# EAGLE design Flag Register (EAGLE 9.6.1)
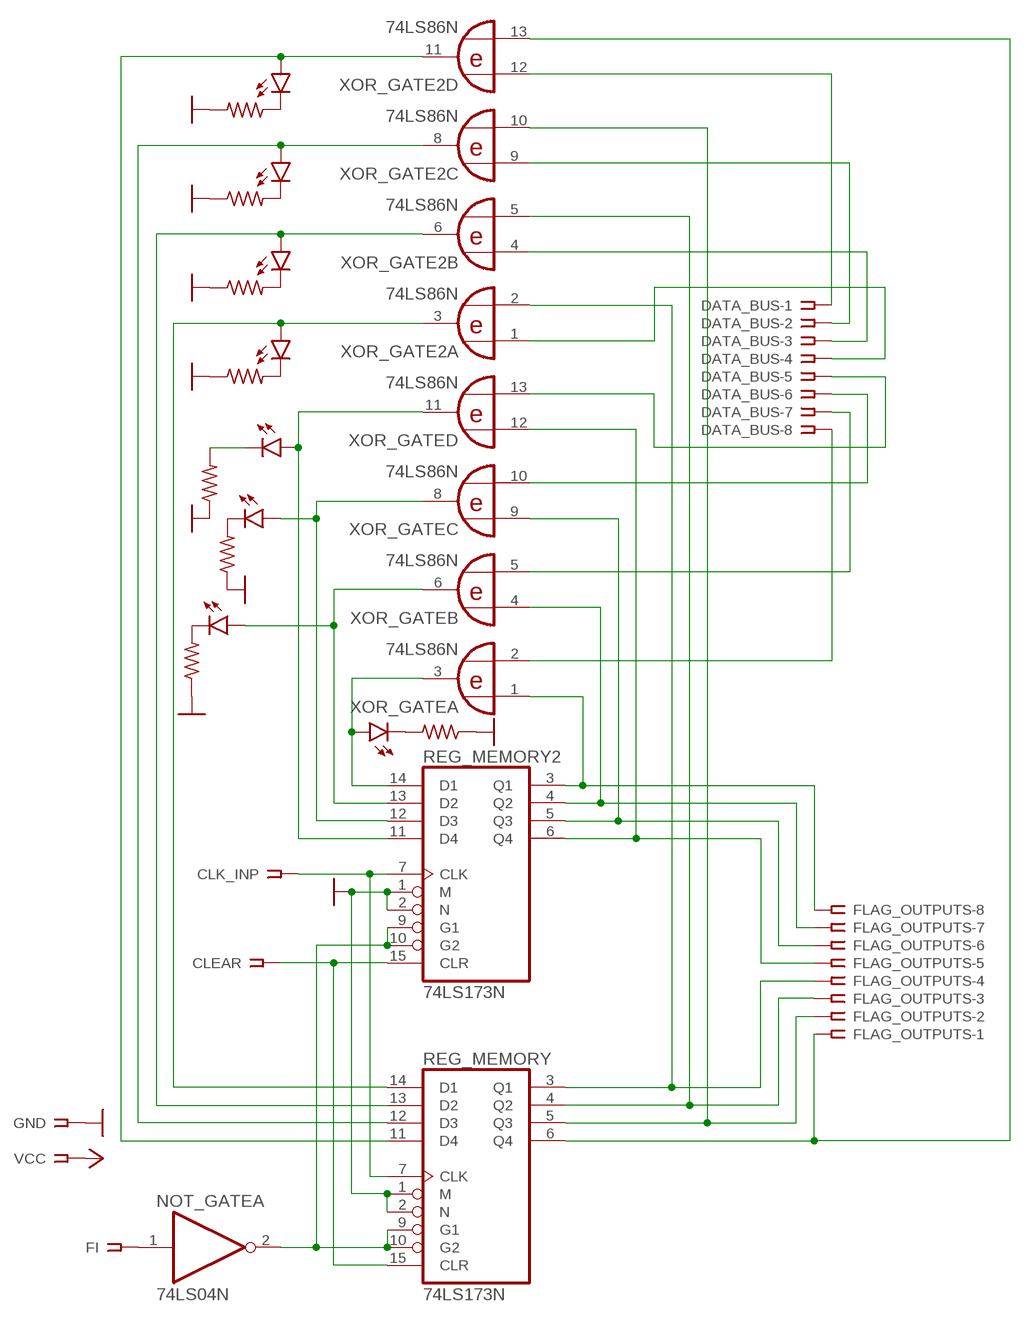
[diagram p0: schematic, sheet 1]

## Parts
CLEAR  SSW-101-02-G-S-RA  [SSW-101-02-G-S-RA]
CLK_INP  SSW-101-02-G-S-RA  [SSW-101-02-G-S-RA]
DATA_BUS  SSW-108-02-G-S  [SSW-108-02-G-S]
FI  SSW-101-02-G-S-RA  [SSW-101-02-G-S-RA]
FLAG_OUTPUTS  SSW-108-02-G-S  [SSW-108-02-G-S]
GND  SSW-101-02-G-S-RA  [SSW-101-02-G-S-RA]
LED1  LED5MM  [LED5MM]
LED2  LED5MM  [LED5MM]
LED3  LED5MM  [LED5MM]
LED4  LED5MM  [LED5MM]
LED5  LED5MM  [LED5MM]
LED6  LED5MM  [LED5MM]
LED7  LED5MM  [LED5MM]
LED8  LED5MM  [LED5MM]
NOT_GATE  74LS04N  [DIL14]
R2  220  R-US_0204/7  [0204/7]
R3  220  R-US_0204/7  [0204/7]
R4  220  R-US_0204/7  [0204/7]
R5  220  R-US_0204/7  [0204/7]
R6  220  R-US_0204/7  [0204/7]
R7  220  R-US_0204/7  [0204/7]
R8  220  R-US_0204/7  [0204/7]
R9  220  R-US_0204/7  [0204/7]
REG_MEMORY  74LS173N  [DIL16]
REG_MEMORY2  74LS173N  [DIL16]
VCC  SSW-101-02-G-S-RA  [SSW-101-02-G-S-RA]
XOR_GATE  74LS86N  [DIL14]
XOR_GATE2  74LS86N  [DIL14]

## Nets
GND: GND.1 R2.2 R3.1 R4.1 R5.1 R6.1 R7.1 R8.1 R9.1 REG_MEMORY2.1(M) REG_MEMORY2.2(N) REG_MEMORY.1(M) REG_MEMORY.2(N)
N$1: CLK_INP.1 REG_MEMORY2.7(CLK) REG_MEMORY.7(CLK)
N$2: FLAG_OUTPUTS.8 REG_MEMORY2.3(Q1) XOR_GATE.1(A:I0)
N$3: CLEAR.1 REG_MEMORY2.15(CLR) REG_MEMORY.15(CLR)
N$4: FLAG_OUTPUTS.7 REG_MEMORY2.4(Q2) XOR_GATE.4(B:I0)
N$5: FLAG_OUTPUTS.6 REG_MEMORY2.5(Q3) XOR_GATE.9(C:I0)
N$6: FLAG_OUTPUTS.5 REG_MEMORY2.6(Q4) XOR_GATE.12(D:I0)
N$7: FLAG_OUTPUTS.1 REG_MEMORY.6(Q4) XOR_GATE2.13(D:I1)
N$8: FLAG_OUTPUTS.2 REG_MEMORY.5(Q3) XOR_GATE2.10(C:I1)
N$9: FLAG_OUTPUTS.3 REG_MEMORY.4(Q2) XOR_GATE2.5(B:I1)
N$10: FLAG_OUTPUTS.4 REG_MEMORY.3(Q1) XOR_GATE2.2(A:I1)
N$11: DATA_BUS.8 XOR_GATE.2(A:I1)
N$12: DATA_BUS.7 XOR_GATE.5(B:I1)
N$13: DATA_BUS.6 XOR_GATE.10(C:I1)
N$14: DATA_BUS.5 XOR_GATE.13(D:I1)
N$15: NOT_GATE.2(A:O) REG_MEMORY2.9(G1) REG_MEMORY2.10(G2) REG_MEMORY.9(G1) REG_MEMORY.10(G2)
N$16: DATA_BUS.4 XOR_GATE2.1(A:I0)
N$17: DATA_BUS.3 XOR_GATE2.4(B:I0)
N$18: DATA_BUS.2 XOR_GATE2.9(C:I0)
N$19: DATA_BUS.1 XOR_GATE2.12(D:I0)
N$20: LED2.K(C) R3.2
N$21: LED8.A REG_MEMORY2.14(D1) XOR_GATE.3(A:O)
N$22: LED7.A REG_MEMORY2.13(D2) XOR_GATE.6(B:O)
N$23: LED6.A REG_MEMORY2.12(D3) XOR_GATE.8(C:O)
N$24: LED5.A REG_MEMORY2.11(D4) XOR_GATE.11(D:O)
N$25: LED4.A REG_MEMORY.14(D1) XOR_GATE2.3(A:O)
N$26: LED3.A REG_MEMORY.13(D2) XOR_GATE2.6(B:O)
N$27: LED2.A REG_MEMORY.12(D3) XOR_GATE2.8(C:O)
N$28: LED1.A REG_MEMORY.11(D4) XOR_GATE2.11(D:O)
N$29: LED3.K(C) R4.2
N$30: LED4.K(C) R5.2
N$31: LED5.K(C) R6.2
N$32: LED6.K(C) R7.2
N$33: LED7.K(C) R8.2
N$34: LED8.K(C) R9.2
N$35: LED1.K(C) R2.1
N$36: FI.1 NOT_GATE.1(A:I)
VCC: VCC.1
Unconnected: NOT_GATE.3(B:I) NOT_GATE.4(B:O) NOT_GATE.5(C:I) NOT_GATE.6(C:O) NOT_GATE.8(D:O) NOT_GATE.9(D:I) NOT_GATE.10(E:O) NOT_GATE.11(E:I) NOT_GATE.12(F:O) NOT_GATE.13(F:I)

## Power pins joined to a net without a drawn wire
GND: NOT_GATE.7(P:GND) REG_MEMORY2.8(GND) REG_MEMORY.8(GND) XOR_GATE2.7(P:GND) XOR_GATE.7(P:GND)
VCC: NOT_GATE.14(P:VCC) REG_MEMORY2.16(VCC) REG_MEMORY.16(VCC) XOR_GATE2.14(P:VCC) XOR_GATE.14(P:VCC)

## Library data of the parts
CLEAR CLK_INP FI GND VCC = con-samtec:SSW-101-02-G-S: THROUGH-HOLE .025" SQ POST SOCKET Source: Samtec SSW.pdf; MF: Samtec Inc.; MPN: SSW-101-02-G-S-RA; OC_FARNELL: unknown; OC_NEWARK: 11P9337
DATA_BUS FLAG_OUTPUTS = con-samtec:SSW-108-02-G-S: THROUGH-HOLE .025" SQ POST SOCKET Source: Samtec SSW.pdf; MF: Samtec Inc.; MPN: SSW-108-02-G-S; OC_FARNELL: unknown; OC_NEWARK: 11P9448
LED1-LED8 = led:LED: LED OSRAM: - CHIPLED LG R971, LG N971, LY N971, LG Q971, LY Q971, LO R971, LY R971 LH N974, LH R974 LS Q976, LO Q976, LY Q976 LO Q996 - Hyper CHIPLED LW Q18S LB Q993, LB Q99A, LB R99A - SideLED LS A670, LO A670, LY A670, LG A670, LP A670 LB A673, LV A673, LT A673, LW A673 LH A674 LY A675 LS A676, LA A676, LO A676, LY A676, LW A676 LS A679, LY A679, LG A679 - Hyper Micro SIDELED® LS Y876, LA Y876, LO Y876, LY Y876 LT Y87S - SmartLED LW L88C, LW L88S LB L89C, LB L89S, LG L890 LS L89K, LO L89K, LY L89K LS L896, LA L896, LO L896, LY L896 - TOPLED LS T670, LO T670, LY T670, LG T670, LP T670 LSG T670, LSP T670, LSY T670, LOP T670, LYG T670 LG T671, LOG T671, LSG T671 LB T673, LV T673, LT T673, LW T673 LH T674 LS T676, LA T676, LO T676, LY T676, LB T676, LH T676, LSB T676, LW T676 LB T67C, LV T67C, LT T67C, LS T67K, LO T67K, LY T67K, LW E67C LS E67B, LA E67B, LO E67B, LY E67B, LB E67C, LV E67C, LT E67C LW T67C LS T679, LY T679, LG T679 LS T770, LO T770, LY T770, LG T770, LP T770 LB T773, LV T773, LT T773, LW T773 LH T774 LS E675, LA E675, LY E675, LS T675 LS T776, LA T776, LO T776, LY T776, LB T776 LHGB T686 LT T68C, LB T68C - Hyper Mini TOPLED® LB M676 - Mini TOPLED Santana® LG M470 LS M47K, LO M47K, LY M47K Source: http://www.osram.convergy.de LUXEON: - LUMILED® LXK2-PW12-R00, LXK2-PW12-S00, LXK2-PW14-U00, LXK2-PW14-V00 LXK2-PM12-R00, LXK2-PM12-S00, LXK2-PM14-U00 LXK2-PE12-Q00, LXK2-PE12-R00, LXK2-PE12-S00, LXK2-PE14-T00, LXK2-PE14-U00 LXK2-PB12-K00, LXK2-PB12-L00, LXK2-PB12-M00, LXK2-PB14-N00, LXK2-PB14-P00, LXK2-PB14-Q00 LXK2-PR12-L00, LXK2-PR12-M00, LXK2-PR14-Q00, LXK2-PR14-R00 LXK2-PD12-Q00, LXK2-PD12-R00, LXK2-PD12-S00 LXK2-PH12-R00, LXK2-PH12-S00 LXK2-PL12-P00, LXK2-PL12-Q00, LXK2-PL12-R00 Source: www.luxeon.com KINGBRIGHT: KA-3528ASYC Source: www.kingbright.com
NOT_GATE = 74xx-eu:74*04: Hex INVERTER
R2-R9 = rcl:R-US_: RESISTOR, American symbol; SPICEPREFIX: R
REG_MEMORY REG_MEMORY2 = 74xx-eu:74*173: 4-bit D type REGISTER, 3-state
XOR_GATE XOR_GATE2 = 74xx-eu:74*86: Quad 2-input EXCLUSIVE-OR (XOR) gate

## Board
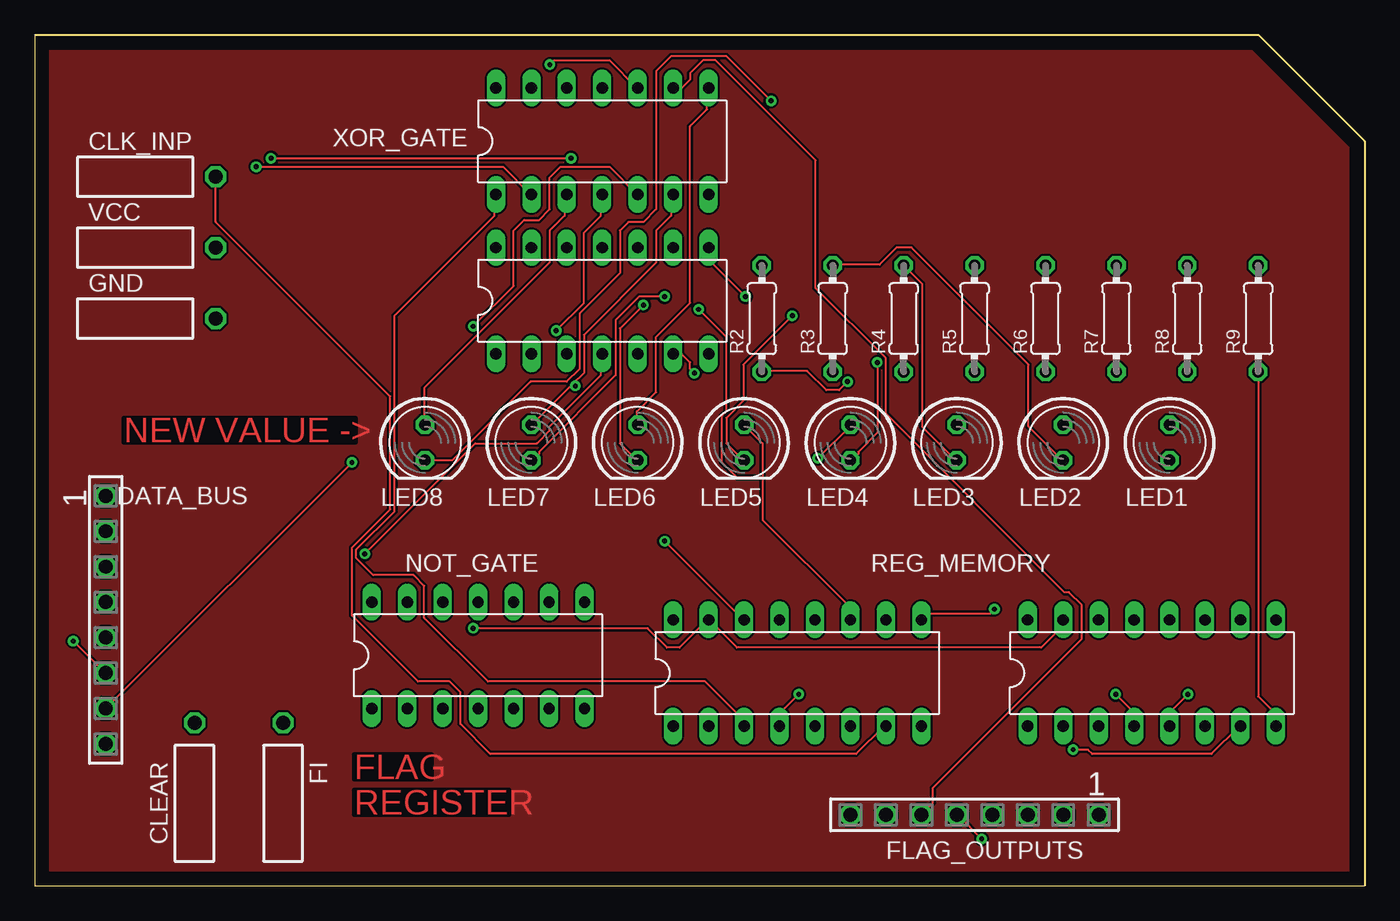
[diagram p1: board, top side]
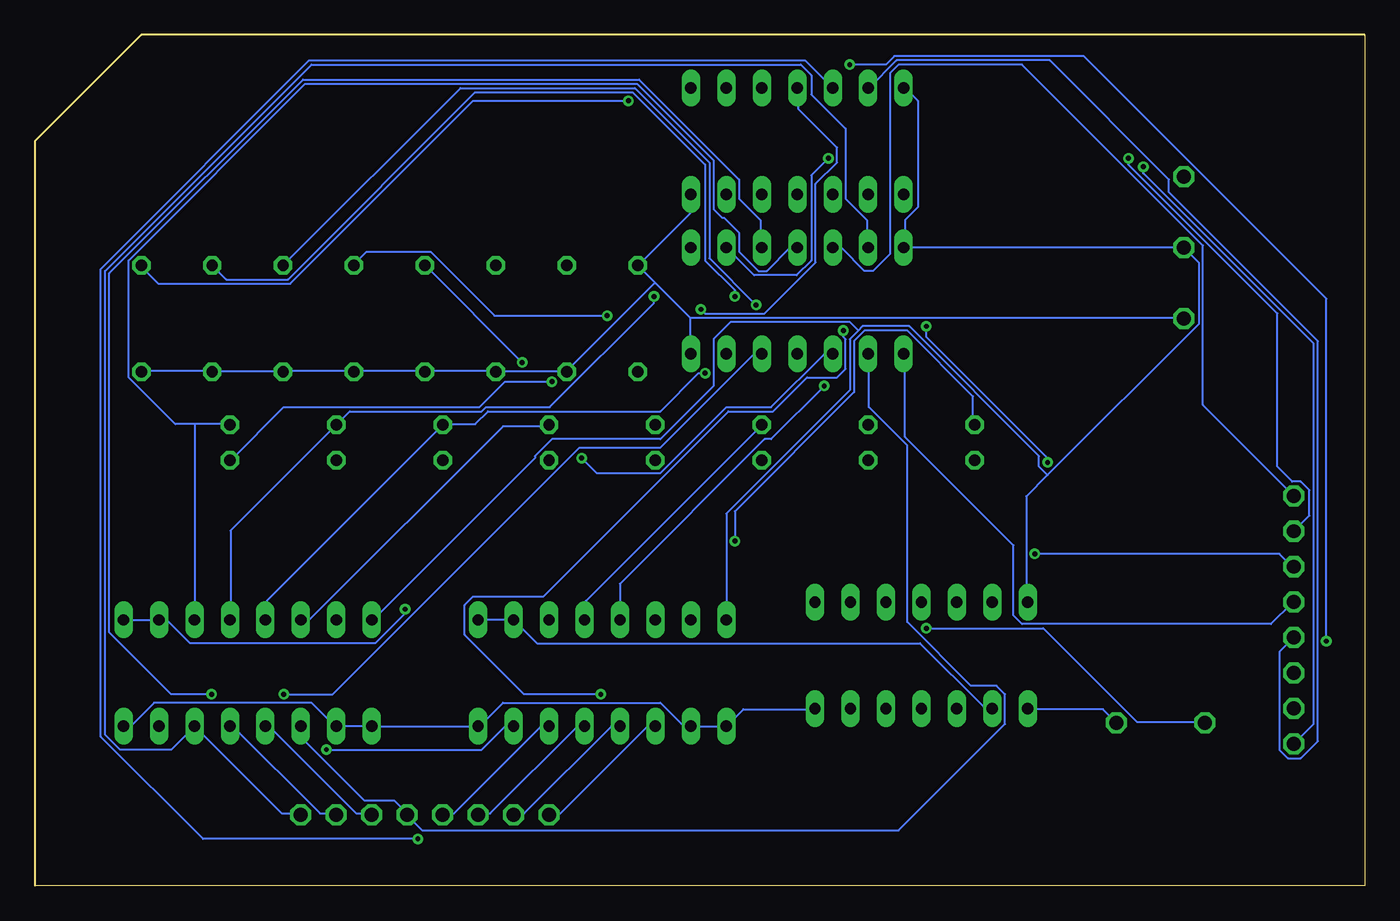
[diagram p2: board, bottom side, seen from below]

Size 95.25 x 60.96 mm. Coordinates in mm from the lower left corner, seen from the top.
Outline: 0,0 95.25,0 95.25,53.34 87.63,60.96 0,60.96 0,0
Copper layers (1*16): Top 0.035mm / dielectric 1.5mm / Bottom 0.035mm
Design rules "default": minimum track width 6mil, minimum drill 0.35mm, track to track 6mil, track to pad 6mil, pad to pad 6mil, via to via 6mil, smd to smd 6mil, copper to edge 40mil, drill to drill 6mil, minimum pad ring 10mil, minimum via ring 8mil, stop-mask expansion 4mil, vias tented up to drill 0mil, thermal gap 10mil

### Footprints (pad centres in the part's own frame; a part is rotated, then mirrored left to right if it is on the bottom)
SSW-101-02-G-S-RA = drill 1 pad 1.5 octagon: 1 0,1.524
SSW-108-02-G-S = drill 1 pad 1.5 octagon: 1 -8.89,0; 2 -6.35,0; 3 -3.81,0; 4 -1.27,0; 5 1.27,0; 6 3.81,0; 7 6.35,0; 8 8.89,0
LED5MM = drill 0.813 octagon: A -1.27,0; K 1.27,0
DIL14 = drill 0.813 long: 1 -7.62,-3.81; 2 -5.08,-3.81; 3 -2.54,-3.81; 4 0,-3.81; 5 2.54,-3.81; 6 5.08,-3.81; 7 7.62,-3.81; 8 7.62,3.81; 9 5.08,3.81; 10 2.54,3.81; 11 0,3.81; 12 -2.54,3.81; 13 -5.08,3.81; 14 -7.62,3.81
0204/7 = drill 0.813 octagon: 1 -3.81,0; 2 3.81,0
DIL16 = drill 0.813 long: 1 -8.89,-3.81; 2 -6.35,-3.81; 3 -3.81,-3.81; 4 -1.27,-3.81; 5 1.27,-3.81; 6 3.81,-3.81; 7 6.35,-3.81; 8 8.89,-3.81; 9 8.89,3.81; 10 6.35,3.81; 11 3.81,3.81; 12 1.27,3.81; 13 -1.27,3.81; 14 -3.81,3.81; 15 -6.35,3.81; 16 -8.89,3.81

### Placement (x,y rotation side)
CLEAR  11.43,10.16 0 top
CLK_INP  11.43,50.8 270 top
DATA_BUS  5.08,19.05 270 top
FI  17.78,10.16 0 top
FLAG_OUTPUTS  67.31,5.08 180 top
GND  11.43,40.64 270 top
LED1  81.28,31.75 270 top
LED2  73.66,31.75 270 top
LED3  66.04,31.75 270 top
LED4  58.42,31.75 270 top
LED5  50.8,31.75 270 top
LED6  43.18,31.75 270 top
LED7  35.56,31.75 270 top
LED8  27.94,31.75 270 top
NOT_GATE  31.75,16.51 0 top
R2  52.07,40.64 90 top
R3  57.15,40.64 90 top
R4  62.23,40.64 90 top
R5  67.31,40.64 90 top
R6  72.39,40.64 90 top
R7  77.47,40.64 90 top
R8  82.55,40.64 90 top
R9  87.63,40.64 90 top
REG_MEMORY  80.01,15.24 0 top
REG_MEMORY2  54.61,15.24 0 top
VCC  11.43,45.72 270 top
XOR_GATE  40.64,53.34 0 top
XOR_GATE2  40.64,41.91 0 top

### Tracks (layer width: path | path; a pad name or v marks a point on that pad's centre or on a via)
GND
  Top 0.152: R9.1 87.63,13.56 88.85,12.34 88.85,11.43 REG_MEMORY.8
  Bottom 0.152: NOT_GATE.7 39.47,12.65 44.5,12.65 REG_MEMORY2.1 REG_MEMORY2.2 48.77,11.43 50.44,13.11 61.72,13.11 63.4,11.43 REG_MEMORY2.8 REG_MEMORY.1 REG_MEMORY.2 73.76,11.43 75.44,13.11 86.72,13.11 88.39,11.43 REG_MEMORY.8 | R9.1 87.63,36.88 82.6,36.88 R8.1 82.45,36.88 77.57,36.88 R7.1 77.42,36.88 72.39,36.88 | 57.15,36.88 62.18,36.88 R4.1 62.33,36.88 67.21,36.88 R5.1 67.36,36.88 72.39,36.88 | 72.39,36.88 R6.1 | 48.31,40.69 48.31,38.1 XOR_GATE2.7 | 50.75,43.13 R2.2 51.97,44.5 48.31,48.16 48.31,49.53 XOR_GATE.7 | 50.75,43.13 48.31,40.69 | 48.31,40.69 12.95,40.69 GND.1 | 57.15,36.88 50.9,43.13 50.75,43.13 | 57.15,36.88 R3.1
MAIN
  pour Top: 0,60.96 87.63,60.96 95.25,53.34 95.25,0 0,0
N$1  (via drill 0.35)
  Top 0.152: v74.37,9.75 75.44,9.75 75.74,9.45 84.28,9.45 86.26,11.43 REG_MEMORY.7 | CLK_INP.1 12.95,47.55 25.45,35.05 25.45,26.98 22.71,24.23 22.71,19.36 27.43,14.63 29.72,14.63 30.48,13.87 30.48,11.58 32.61,9.45 58.83,9.45 60.81,11.43 REG_MEMORY2.7
  Bottom 0.152: REG_MEMORY2.7 61.57,11.43 63.25,9.75 v74.37,9.75
N$2
  Top 0.152: XOR_GATE.1 32.92,49.53 32.92,48.01 25.76,40.84 25.76,26.82 23.01,24.08 23.01,23.47 24.23,22.25 27.13,22.25 27.89,21.49 27.89,19.2 32.46,14.63 48.01,14.63 50.75,11.89 50.75,11.43 REG_MEMORY2.3
  Bottom 0.152: REG_MEMORY2.3 51.36,11.43 57.61,5.18 58.37,5.18 FLAG_OUTPUTS.8
N$3  (via drill 0.35)
  Top 0.152: REG_MEMORY.15 73.61,19.05 73.61,18.59 72.08,17.07 50.29,17.07 48.31,19.05 REG_MEMORY2.15 48.16,19.05 46.18,17.07 45.26,17.07 43.89,18.44 v31.39,18.44
  Bottom 0.152: v31.39,18.44 23.01,18.44 16.31,11.73 11.43,11.73 CLEAR.1
N$4  (via drill 0.35)
  Top 0.152: v37.34,39.78 39.32,41.76 39.32,46.79 40.54,48.01 40.54,49.53 XOR_GATE.4 | v54.71,13.72 53.34,12.34 REG_MEMORY2.4
  Bottom 0.152: REG_MEMORY2.4 53.95,11.43 60.2,5.18 60.96,5.18 FLAG_OUTPUTS.7 | v37.34,39.78 37.34,39.32 37.19,39.17 37.19,37.03 37.8,36.42 39.93,36.42 42.37,33.98 45.57,33.98 58.83,20.73 63.86,20.73 64.47,20.12 64.47,17.98 60.2,13.72 v54.71,13.72
N$5
  Top 0.152: XOR_GATE.9 46.33,57.15 46.94,57.76 46.94,58.22 47.85,59.13 48.77,59.13 55.93,51.97 55.93,42.82 60.96,37.8 60.96,33.83 73.76,21.03 74.07,21.03 74.98,20.12 74.98,17.68 64.31,7.01 64.31,5.94 63.55,5.18 FLAG_OUTPUTS.6
  Bottom 0.152: REG_MEMORY2.5 56.39,11.43 62.64,5.18 63.4,5.18 FLAG_OUTPUTS.6
N$6  (via drill 0.35)
  Top 0.152: v67.82,3.35 66.14,5.03 FLAG_OUTPUTS.5
  Bottom 0.152: REG_MEMORY2.6 58.98,11.43 65.23,5.18 65.99,5.18 FLAG_OUTPUTS.5 | XOR_GATE.12 40.08,59.13 75.59,59.13 90.53,44.2 90.53,10.67 83.21,3.35 v67.82,3.35
N$7
  Bottom 0.152: XOR_GATE2.13 35.66,45.72 35.66,47.7 37.19,49.23 37.19,54.25 39.62,56.69 39.62,58.06 40.39,58.83 75.44,58.83 90.22,44.04 90.22,10.82 89.15,9.75 85.5,9.75 REG_MEMORY.6 77.57,5.18 76.2,5.18 FLAG_OUTPUTS.1
N$8  (via drill 0.35)
  Top 0.152: v82.6,13.72 81.38,12.5 81.38,11.43 REG_MEMORY.5
  Bottom 0.152: v82.6,13.72 85.5,13.72 89.92,18.14 89.92,43.89 76.05,57.76 51.97,57.76 44.81,50.6 44.81,49.23 43.28,47.7 43.28,45.72 XOR_GATE2.10 | REG_MEMORY.5 81.08,11.43 74.83,5.18 73.76,5.18 FLAG_OUTPUTS.2
N$9  (via drill 0.35)
  Top 0.152: v77.42,13.72 78.64,12.5 78.64,11.43 REG_MEMORY.4
  Bottom 0.152: XOR_GATE2.5 43.74,38.1 50.44,31.39 56.24,31.39 73.91,13.72 v77.42,13.72 | REG_MEMORY.4 78.49,11.43 72.24,5.18 71.17,5.18 FLAG_OUTPUTS.3
N$10
  Bottom 0.152: XOR_GATE2.2 35.51,38.1 35.51,34.29 32.77,31.55 32.77,18.9 28.19,14.33 26.36,14.33 25.76,13.72 25.76,11.58 33.38,3.96 67.51,3.96 68.58,5.03 FLAG_OUTPUTS.4 68.58,5.18 69.49,6.1 71.63,6.1 76.2,10.67 REG_MEMORY.3
N$11  (via drill 0.35)
  Top 0.152: v15.85,51.51 33.53,51.51 35.51,49.53 XOR_GATE.2
  Bottom 0.152: v15.85,51.51 15.85,51.05 3.66,38.86 3.66,11.58 DATA_BUS.8
N$12  (via drill 0.35)
  Top 0.152: v31.39,40.08 34.29,42.98 34.29,46.94 35.05,47.7 36.12,47.7 36.88,48.46 36.88,50.75 37.64,51.51 41.15,51.51 43.13,49.53 XOR_GATE.5 | DATA_BUS.7 v22.71,30.33
  Bottom 0.152: v31.39,40.08 31.39,39.32 22.71,30.63 v22.71,30.33
N$13  (via drill 0.35)
  Top 0.152: v36.88,58.83 37.19,59.13 41.15,59.13 43.13,57.15 XOR_GATE.10 | v2.74,17.53 5.03,15.24 DATA_BUS.6
  Bottom 0.152: v36.88,58.83 34.29,58.83 33.68,59.44 20.12,59.44 2.74,42.06 v2.74,17.53
N$14
  Bottom 0.152: DATA_BUS.5 6.1,16.76 6.1,9.75 5.49,9.14 4.57,9.14 3.35,10.36 3.35,39.01 14.02,49.68 14.02,50.6 22.55,59.13 33.53,59.13 35.51,57.15 XOR_GATE.13
N$15  (via drill 0.35)
  Top 0.152: v68.73,19.81 68.43,19.51 64.01,19.51 63.55,19.05 REG_MEMORY2.9
  Bottom 0.152: REG_MEMORY.9 REG_MEMORY.10 85.8,19.05 84.12,17.37 70.87,17.37 68.73,19.51 v68.73,19.81 | NOT_GATE.2 26.67,12.8 27.28,12.8 31.85,17.37 59.28,17.37 REG_MEMORY2.10 REG_MEMORY2.9
N$16
  Bottom 0.152: XOR_GATE2.1 32.92,38.1 32.92,32.16 25.15,24.38 25.15,19.36 24.54,18.75 6.71,18.75 5.18,20.27 DATA_BUS.4
N$17  (via drill 0.35)
  Top 0.152: v23.62,23.77 31.55,31.7 35.97,31.7 36.88,32.61 36.88,32.92 40.54,36.58 40.54,38.1 XOR_GATE2.4
  Bottom 0.152: v23.62,23.77 6.1,23.77 5.18,22.86 DATA_BUS.3
N$18  (via drill 0.35)
  Top 0.152: v16.92,52.12 v38.41,52.12
  Bottom 0.152: XOR_GATE2.9 43.74,43.74 40.69,43.74 39.62,44.81 39.62,50.9 v38.41,52.12 | v16.92,52.12 16.92,51.66 6.25,41 6.25,30.02 5.18,28.96 4.57,28.96 3.96,28.35 3.96,26.52 DATA_BUS.2
N$19
  Bottom 0.152: XOR_GATE2.12 37.49,45.72 35.81,44.04 35.2,44.04 33.98,45.26 33.98,58.22 33.38,58.83 24.54,58.83 11.58,45.87 11.58,34.44 DATA_BUS.1
N$20
  Top 0.152: R3.2 57.15,44.5 60.5,44.5 61.72,45.72 62.79,45.72 71.17,37.34 71.17,32.92 73.61,30.48 LED2.K
N$21  (via drill 0.35)
  Top 0.152: XOR_GATE.3 37.95,49.38 37.95,48.01 36.88,46.94 36.88,44.65 27.89,35.66 27.89,33.07 LED8.A | v45.11,24.69 50.75,19.05 REG_MEMORY2.14
  Bottom 0.152: v45.11,24.69 45.11,26.82 36.58,35.36 36.58,39.01 35.81,39.78 32.77,39.78 28.04,35.05 28.04,33.07 LED8.A
N$22  (via drill 0.35)
  Top 0.152: 38.56,35.97 39.32,36.73 39.32,39.47 44.5,44.65 44.5,46.94 45.57,48.01 45.57,49.38 XOR_GATE.6 | 38.56,35.97 35.66,33.07 LED7.A | 38.56,35.97 v38.71,35.81
  Bottom 0.152: REG_MEMORY2.13 53.34,21.64 42.98,32 42.52,32 v38.71,35.81
N$23
  Top 0.152: XOR_GATE.8 48.16,57.15 48.16,55.63 46.94,54.41 46.94,41.76 44.5,39.32 44.5,35.36 43.13,33.98 43.13,33.07 LED6.A
  Bottom 0.152: LED6.A 55.78,20.42 55.78,19.05 REG_MEMORY2.12
N$24  (via drill 0.35)
  Top 0.152: 52.12,29.26 52.12,31.7 LED5.A | 52.12,29.26 52.12,26.21 58.37,19.96 58.37,19.05 REG_MEMORY2.11 | v47.55,41.3 49.53,39.32 49.53,33.98 49.23,33.68 49.23,30.33 50.29,29.26 52.12,29.26
  Bottom 0.152: v47.55,41.3 47.24,41 42.98,41 39.32,44.65 39.32,50.29 37.8,51.82 37.8,52.88 40.54,55.63 40.54,57.15 XOR_GATE.11
N$25  (via drill 0.35)
  Top 0.152: v56.08,30.63 58.37,32.92 LED4.A
  Bottom 0.152: XOR_GATE2.3 38.71,38.1 42.52,34.29 45.72,34.29 50.44,29.57 55.02,29.57 v56.08,30.63 | REG_MEMORY.14 75.59,19.05 61.72,32.92 58.52,32.92 LED4.A
N$26  (via drill 0.35)
  Top 0.152: XOR_GATE2.6 46.33,38.1 46.94,37.49 46.94,37.03 v47.24,36.73
  Bottom 0.152: v47.24,36.73 47.7,36.73 50.44,33.98 62.79,33.98 63.7,33.07 65.99,33.07 LED3.A 78.64,20.42 78.64,19.05 REG_MEMORY.13
N$27  (via drill 0.35)
  Top 0.152: v50.9,42.22 48.31,44.81 48.31,45.72 XOR_GATE2.8
  Bottom 0.152: v50.9,42.22 50.9,41.76 58.37,34.29 62.94,34.29 63.25,33.98 72.69,33.98 LED2.A 81.23,25.45 81.23,19.05 REG_MEMORY.12
N$28
  Bottom 0.152: XOR_GATE2.11 41.15,45.72 42.82,44.04 43.43,44.04 44.81,45.41 44.81,46.79 45.87,47.85 46.02,47.85 46.63,48.46 46.63,51.97 52.12,57.45 75.89,57.45 88.54,44.81 88.54,36.42 85.19,33.07 83.82,33.07 | 83.82,33.07 81.38,33.07 LED1.A | 83.82,33.07 REG_MEMORY.11
N$29
  Top 0.152: R4.2 63.55,43.13 63.55,32.92 65.99,30.48 LED3.K
N$30  (via drill 0.35)
  Top 0.152: v60.35,37.49 60.35,32.46 58.98,31.09 58.98,30.94 58.52,30.48 LED4.K
  Bottom 0.152: R5.2 v60.35,37.49
N$31  (via drill 0.35)
  Top 0.152: v54.25,40.84 50.75,37.34 50.75,34.75 49.53,33.53 49.53,31.7 50.75,30.48 LED5.K
  Bottom 0.152: v54.25,40.84 62.33,40.84 66.9,45.41 71.48,45.41 72.39,44.5 R6.2
N$32  (via drill 0.35)
  Top 0.152: v43.59,41.6 41.91,39.93 41.91,31.7 43.13,30.48 LED6.K
  Bottom 0.152: v43.59,41.6 46.94,44.96 46.94,51.82 52.27,57.15 64.77,57.15 R7.2
N$33  (via drill 0.35)
  Top 0.152: v45.11,42.22 43.28,42.22 41.6,40.54 41.6,36.58 36.12,31.09 36.12,30.94 35.66,30.48 LED7.K
  Bottom 0.152: v45.11,42.22 45.11,42.67 47.24,44.81 47.24,51.66 52.43,56.84 63.7,56.84 77.11,43.43 81.53,43.43 R8.2
N$34  (via drill 0.35)
  Top 0.152: LED8.K 29.87,30.48 35.51,36.12 38.1,36.12 39.01,37.03 39.01,41 41.91,43.89 41.91,46.94 42.52,47.55 43.59,47.55 44.5,48.46 44.5,58.37 45.57,59.44 49.53,59.44 v52.73,56.24
  Bottom 0.152: v52.73,56.24 63.86,56.24 76.96,43.13 86.41,43.13 87.63,44.35 R9.2
N$35  (via drill 0.35)
  Top 0.152: v58.22,36.12 57.61,35.51 56.69,35.51 55.32,36.88 52.12,36.88 R2.1
  Bottom 0.152: v58.22,36.12 61.57,36.12 63.4,34.29 77.42,34.29 81.23,30.48 LED1.K
N$36
  Bottom 0.152: FI.1 18.75,12.65 24.08,12.65 NOT_GATE.1
VCC
  Bottom 0.152: 32.92,45.72 32.92,47.7 32,48.62 32,56.24 32.92,57.15 XOR_GATE.14 | 22.71,29.41 11.89,40.23 11.89,44.65 VCC.1 32.92,45.72 | 22.71,29.41 24.23,27.89 24.23,20.42 NOT_GATE.14 | REG_MEMORY2.16 45.72,26.67 36.88,35.51 36.88,39.17 36.27,39.78 | 36.27,39.78 35.97,40.08 32.61,40.08 23.32,30.79 23.32,30.02 22.71,29.41 | 36.27,39.78 36.88,40.39 45.41,40.39 46.63,39.17 46.63,35.81 50.44,32 58.22,32 59.44,30.79 59.44,30.63 71.02,19.05 REG_MEMORY.16 | 32.92,45.72 XOR_GATE2.14

### Text on the board
Top: NEW VALUE -> | FLAG | REGISTER